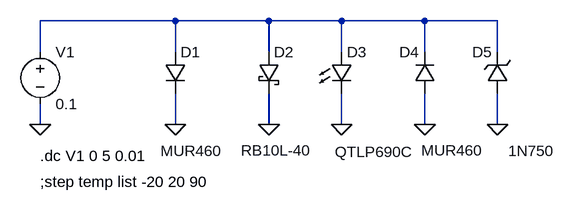
[diagram p0: schematic CaracteristicaDiodo.asc]
CaracteristicaDiodo.asc, the LTspice schematic file:
Version 4
SHEET 1 880 680
WIRE 288 48 80 48
WIRE 432 48 288 48
WIRE 544 48 432 48
WIRE 672 48 544 48
WIRE 784 48 672 48
WIRE 80 96 80 48
WIRE 288 96 288 48
WIRE 432 96 432 48
WIRE 544 96 544 48
WIRE 672 96 672 48
WIRE 784 96 784 48
WIRE 80 208 80 176
WIRE 288 208 288 160
WIRE 432 208 432 160
WIRE 544 208 544 160
WIRE 672 208 672 160
WIRE 784 208 784 160
FLAG 80 208 0
FLAG 288 208 0
FLAG 432 208 0
FLAG 544 208 0
FLAG 672 208 0
FLAG 784 208 0
SYMBOL voltage 80 80 R0
WINDOW 123 0 0 Left 2
WINDOW 39 0 0 Left 2
SYMATTR InstName V1
SYMATTR Value 0.1
SYMBOL diode 272 96 R0
WINDOW 3 -7 153 Left 2
SYMATTR Value MUR460
SYMATTR InstName D1
SYMBOL schottky 416 96 R0
WINDOW 3 -27 152 Left 2
SYMATTR Value RB10L-40
SYMATTR InstName D2
SYMATTR Description Diode
SYMATTR Type diode
SYMBOL LED 528 96 R0
WINDOW 3 6 154 Left 2
SYMATTR Value QTLP690C
SYMATTR InstName D3
SYMATTR Description Diode
SYMATTR Type diode
SYMBOL diode 688 160 R180
WINDOW 0 24 64 Left 2
WINDOW 3 -74 -88 Left 2
SYMATTR InstName D4
SYMATTR Value MUR460
SYMBOL zener 800 160 R180
WINDOW 0 24 64 Left 2
WINDOW 3 -72 -89 Left 2
SYMATTR InstName D5
SYMATTR Value 1N750
SYMATTR Description Diode
SYMATTR Type diode
TEXT 80 256 Left 2 !.dc V1 0 5 0.01
TEXT 80 296 Left 2 !;step temp list -20 20 90

The netlist it stands for:
* CaracteristicaDiodo.asc
V1 N001 0 0.1
D1 N001 0 MUR460
D2 N001 0 RB10L-40
D3 N001 0 QTLP690C
D4 0 N001 MUR460
D5 0 N001 1N750
.model D D
.lib standard.dio
.dc V1 0 5 0.01
;step temp list -20 20 90
.backanno
.end